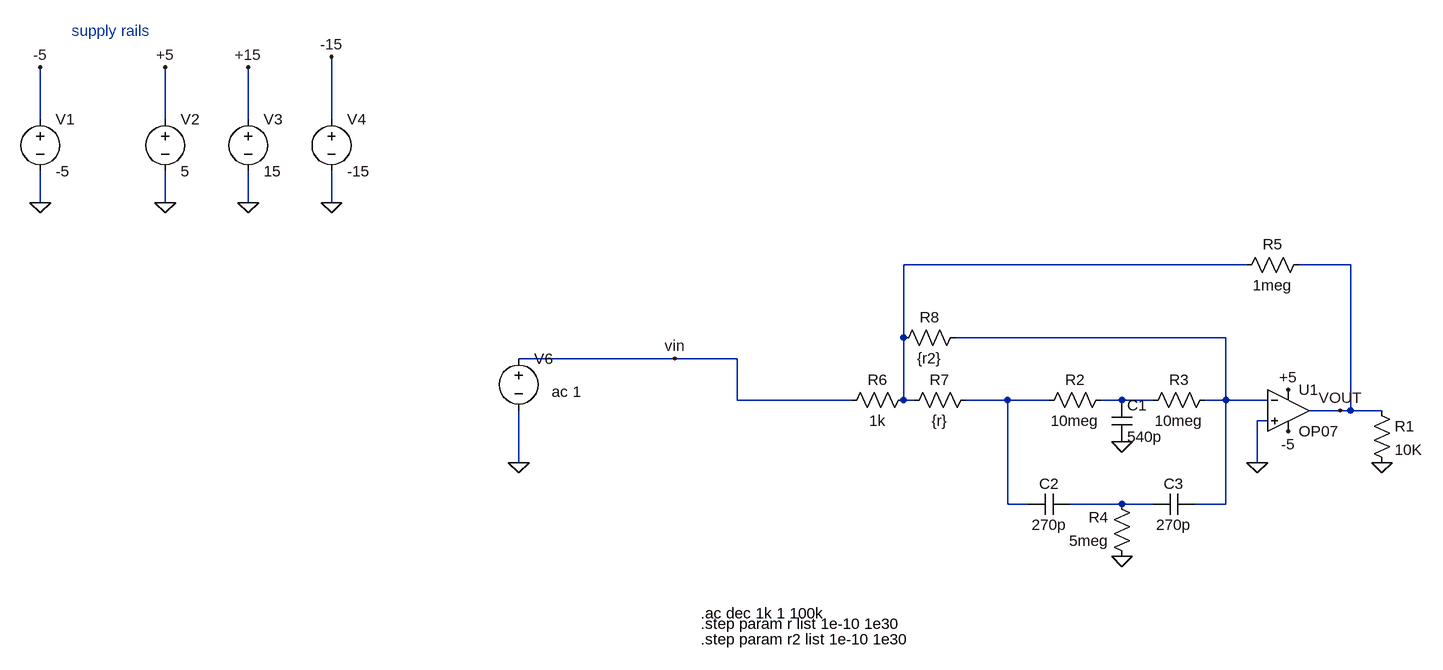
[diagram p0: schematic line_Filter.asc]
line_Filter.asc, the LTspice schematic file:
Version 4
SHEET 1 1316 736
WIRE -816 -80 -816 -160
WIRE -624 -80 -624 -160
WIRE -496 -80 -496 -160
WIRE -368 -80 -368 -176
WIRE -816 48 -816 0
WIRE -624 48 -624 0
WIRE -496 48 -496 0
WIRE -368 48 -368 0
WIRE 1040 144 512 144
WIRE 1200 144 1120 144
WIRE 512 256 512 144
WIRE 1008 256 592 256
WIRE 160 288 -80 288
WIRE 256 288 160 288
WIRE 256 352 256 288
WIRE 432 352 256 352
WIRE 512 352 512 256
WIRE 528 352 512 352
WIRE 672 352 608 352
WIRE 736 352 672 352
WIRE 848 352 816 352
WIRE 896 352 848 352
WIRE 1008 352 1008 256
WIRE 1008 352 976 352
WIRE 1072 352 1008 352
WIRE 1184 368 1136 368
WIRE 1200 368 1200 144
WIRE 1200 368 1184 368
WIRE 1248 368 1200 368
WIRE 1072 384 1056 384
WIRE -80 448 -80 368
WIRE 1056 448 1056 384
WIRE 672 512 672 352
WIRE 704 512 672 512
WIRE 848 512 768 512
WIRE 896 512 848 512
WIRE 1008 512 1008 352
WIRE 1008 512 960 512
FLAG -624 -160 +5
FLAG -816 -160 -5
FLAG -624 48 0
FLAG -816 48 0
FLAG -496 48 0
FLAG -368 48 0
FLAG -496 -160 +15
FLAG -368 -176 -15
FLAG 1104 336 +5
FLAG 1104 400 -5
FLAG -80 448 0
FLAG 1248 448 0
FLAG 1184 368 VOUT
FLAG 160 288 vin
FLAG 848 416 0
FLAG 848 592 0
FLAG 1056 448 0
SYMBOL voltage -816 -96 R0
SYMATTR InstName V1
SYMATTR Value -5
SYMBOL voltage -624 -96 R0
SYMATTR InstName V2
SYMATTR Value 5
SYMBOL voltage -496 -96 R0
SYMATTR InstName V3
SYMATTR Value 15
SYMBOL voltage -368 -96 R0
SYMATTR InstName V4
SYMATTR Value -15
SYMBOL Opamps/OP07 1104 304 R0
SYMATTR InstName U1
SYMBOL voltage -80 272 R0
WINDOW 3 51 67 Left 2
SYMATTR Value ac 1
SYMATTR InstName V6
SYMBOL res 1232 352 R0
SYMATTR InstName R1
SYMATTR Value 10K
SYMBOL res 832 336 R90
WINDOW 0 0 56 VBottom 2
WINDOW 3 32 56 VTop 2
SYMATTR InstName R2
SYMATTR Value 10meg
SYMBOL res 992 336 R90
WINDOW 0 0 56 VBottom 2
WINDOW 3 32 56 VTop 2
SYMATTR InstName R3
SYMATTR Value 10meg
SYMBOL res 864 608 R180
WINDOW 0 36 76 Left 2
WINDOW 3 36 40 Left 2
SYMATTR InstName R4
SYMATTR Value 5meg
SYMBOL res 1024 160 R270
WINDOW 0 32 56 VTop 2
WINDOW 3 0 56 VBottom 2
SYMATTR InstName R5
SYMATTR Value 1meg
SYMBOL res 416 368 R270
WINDOW 0 32 56 VTop 2
WINDOW 3 0 56 VBottom 2
SYMATTR InstName R6
SYMATTR Value 1k
SYMBOL cap 832 352 R0
SYMATTR InstName C1
SYMATTR Value 540p
SYMBOL cap 768 496 R90
WINDOW 0 0 32 VBottom 2
WINDOW 3 32 32 VTop 2
SYMATTR InstName C2
SYMATTR Value 270p
SYMBOL cap 960 496 R90
WINDOW 0 0 32 VBottom 2
WINDOW 3 32 32 VTop 2
SYMATTR InstName C3
SYMATTR Value 270p
SYMBOL res 624 336 R90
WINDOW 0 0 56 VBottom 2
WINDOW 3 32 56 VTop 2
SYMATTR InstName R7
SYMATTR Value {r}
SYMBOL res 608 240 R90
WINDOW 0 0 56 VBottom 2
WINDOW 3 32 56 VTop 2
SYMATTR InstName R8
SYMATTR Value {r2}
TEXT -768 -216 Left 2 ;supply rails
TEXT 200 680 Left 2 !.ac dec 1k 1 100k
TEXT 200 696 Left 2 !.step param r list 1e-10 1e30
TEXT 200 720 Left 2 !.step param r2 list 1e-10 1e30

The netlist it stands for:
* line_Filter.asc
V1 -5 0 -5
V2 +5 0 5
V3 +15 0 15
V4 -15 0 -15
XU1 0 N002 +5 -5 VOUT LT1001  ; OP07, pins In+ In- V+ V- OUT
V6 vin 0 ac 1
R1 VOUT 0 10K
R2 N004 N003 10meg
R3 N002 N004 10meg
R4 0 N005 5meg
R5 N001 VOUT 1meg
R6 vin N001 1k
C1 N004 0 540p
C2 N005 N003 270p
C3 N002 N005 270p
R7 N003 N001 {r}
R8 N002 N001 {r2}
* supply rails
.ac dec 1k 1 100k
.step param r list 1e-10 1e30
.step param r2 list 1e-10 1e30
.lib LTC.lib
.backanno
.end